# Altium schematic sheet MCU.SchDoc
size B; SheetNumber: 1; SheetTotal: 5
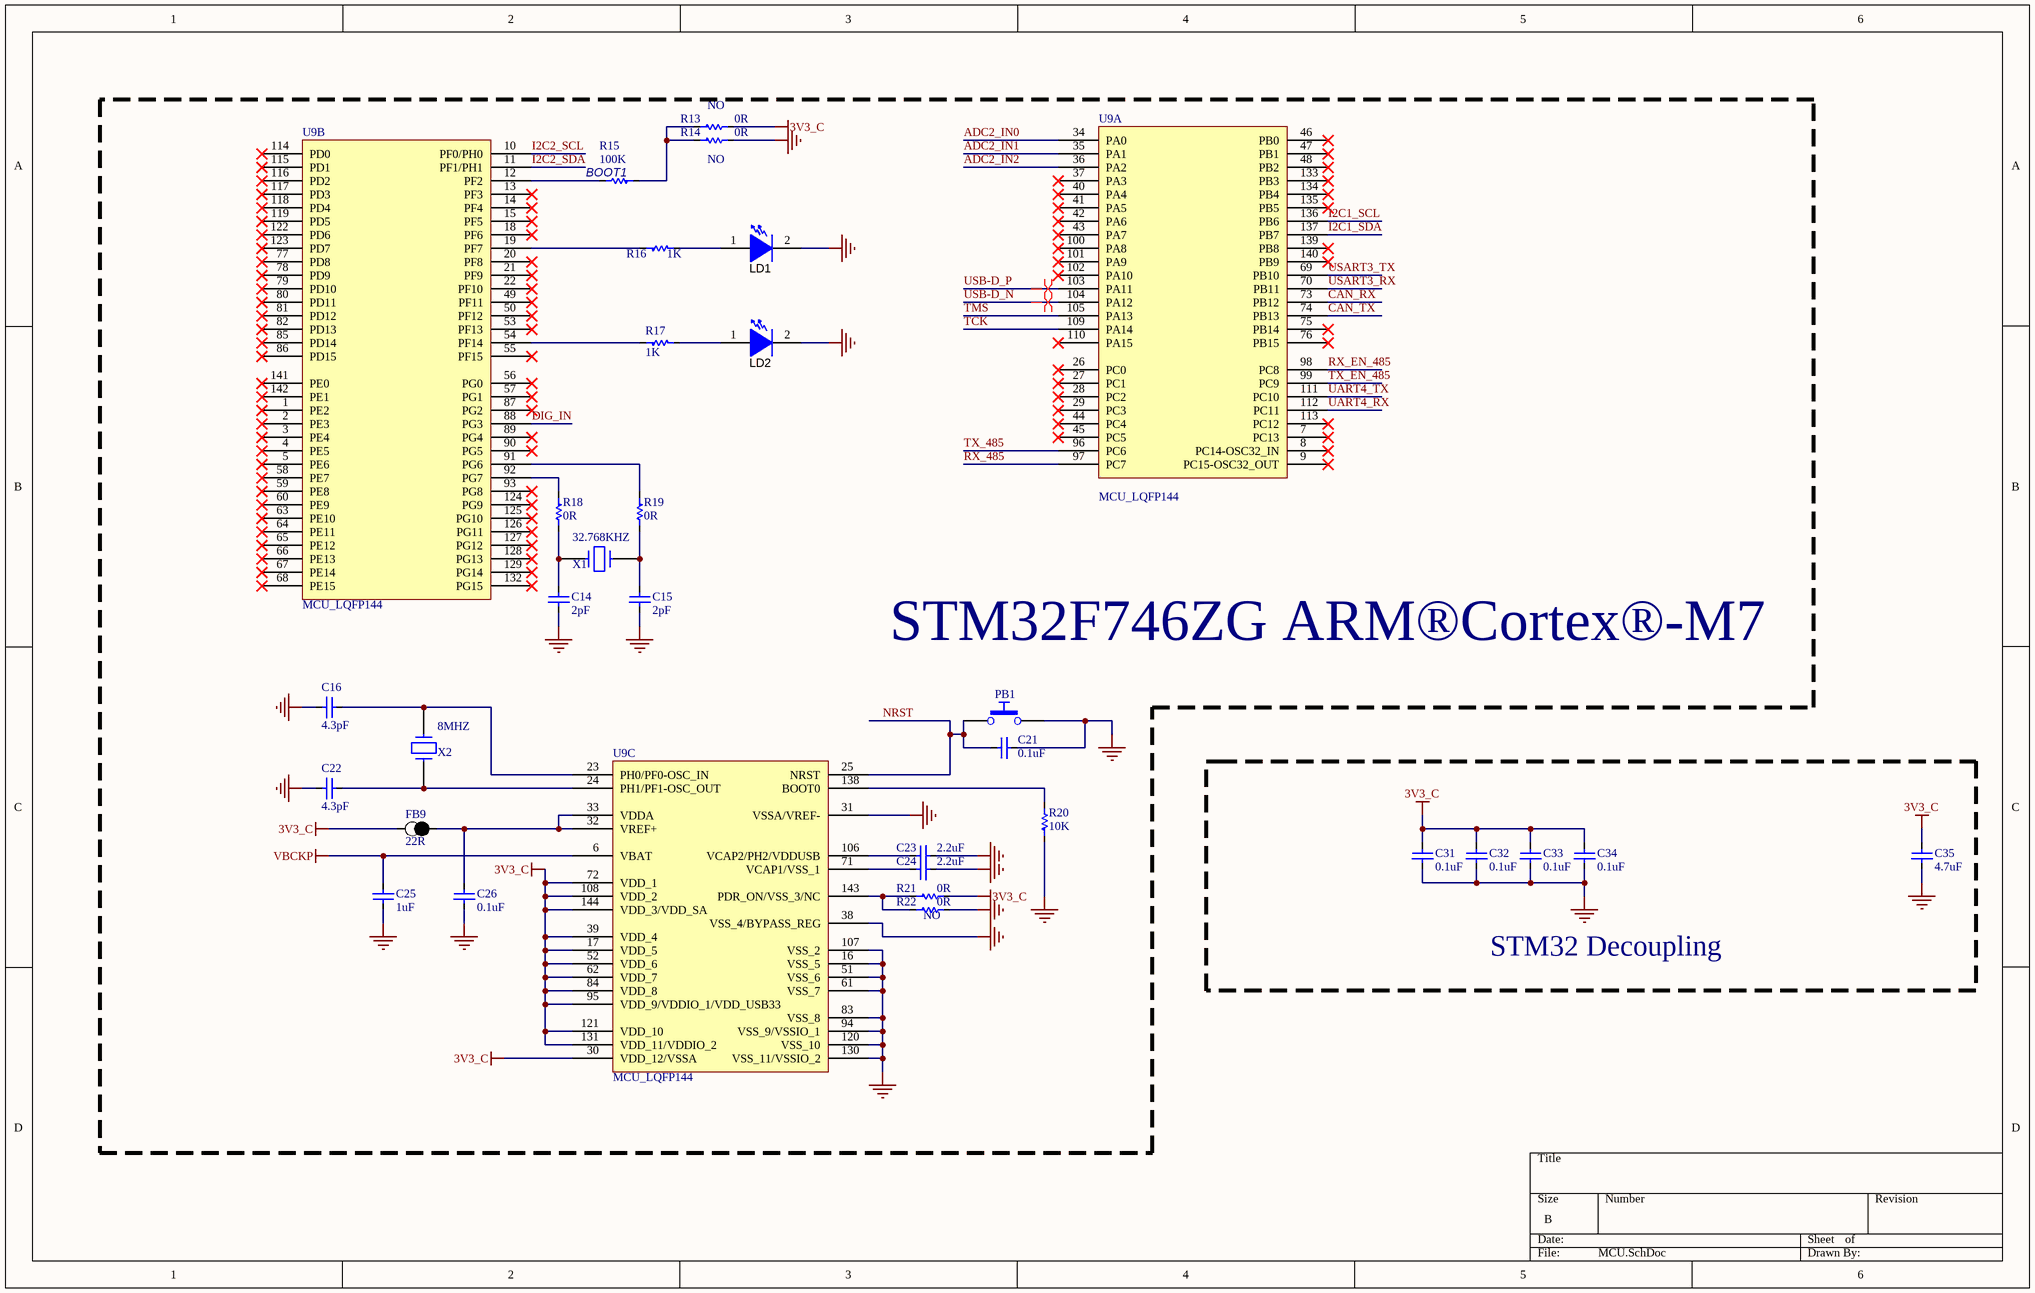
[diagram p0: MCU.SchDoc]

## Parts
C14  2pF  [CAPC1608-0603X85N]
C15  2pF  [CAPC1608-0603X85N]
C16  4.3pF  [CAPC1005-0402X55N]
C21  0.1uF  [CAPC1608-0603X85N]
C22  4.3pF  [CAPC1005-0402X55N]
C23  2.2uF  [CAPC2012-0805X80N]
C24  2.2uF  [CAPC2012-0805X80N]
C25  1uF  [CAPC1608-0603X85N]
C26  0.1uF  [CAPC1608-0603X85N]
C31  0.1uF  [CAPC1608-0603X85N]
C32  0.1uF  [CAPC1608-0603X85N]
C33  0.1uF  [CAPC1608-0603X85N]
C34  0.1uF  [CAPC1608-0603X85N]
C35  4.7uF  [CAPC1608-0603X85N]
FB9  22R  [INDC1608-0603X50N]
LD1  160-1183-1-ND  [LED_LTST-C190]  (value not drawn)
LD2  160-1183-1-ND  [LED_LTST-C190]  (value not drawn)
PB1  Push Button  [PB_TYCO_FSMSM]  (value not drawn)
R13  0R  POPULATED: NO  [RESC1608-0603X50N]
R14  0R  POPULATED: NO  [RESC1608-0603X50N]
R15  100K  [RESC1608-0603X50N]
R16  1K  [RESC1608-0603X50N]
R17  1K  [RESC1608-0603X50N]
R18  0R  [RESC1608-0603X50N]
R19  0R  [RESC1608-0603X50N]
R20  10K  [RESC1608-0603X50N]
R21  0R  [RESC1608-0603X50N]
R22  0R  POPULATED: NO  [RESC1608-0603X50N]
U9  MCU_LQFP144  [QFP50P2200X2200X160-144N]  (parts A,B,C of 3)
X1  32.768KHZ  [2-SMD]
X2  8MHZ  [2-SMD]

## Blocks framed on the sheet
STM32F746ZG ARM®Cortex®-M7: C14-C16 C21-C26 FB9 LD1 LD2 PB1 R13-R22 U9 X1 X2
STM32 Decoupling: C31-C35

## Nets
3V3_C: C31.1 C32.1 C33.1 C34.1 C35.1 FB9.2 R13.2 R21.2 U9.17(VDD_5) U9.30(VDD_12/VSSA) U9.39(VDD_4) U9.52(VDD_6) U9.62(VDD_7) U9.72(VDD_1) U9.84(VDD_8) U9.95(VDD_9/VDDIO_1/VDD_USB33) U9.108(VDD_2) U9.121(VDD_10) U9.131(VDD_11/VDDIO_2) U9.144(VDD_3/VDD_SA)
GND: C14.2 C15.2 C16.2 C21.2 C22.2 C23.2 C24.2 C25.1 C26.2 C31.2 C32.2 C33.2 C34.2 C35.2 LD1.2(K) LD2.2(K) PB1.2 R14.2 R20.1 R22.2 U9.16(VSS_5) U9.31(VSSA/VREF-) U9.38(VSS_4/BYPASS_REG) U9.51(VSS_6) U9.61(VSS_7) U9.83(VSS_8) U9.94(VSS_9/VSSIO_1) U9.107(VSS_2) U9.120(VSS_10) U9.130(VSS_11/VSSIO_2)
VBCKP: C25.2 U9.6(VBAT)
ADC2_IN0: U9.34(PA0)
ADC2_IN1: U9.35(PA1)
ADC2_IN2: U9.36(PA2)
CAN_RX: U9.73(PB12)
CAN_TX: U9.74(PB13)
DIG_IN: U9.88(PG3)
I2C1_SCL: U9.136(PB6)
I2C1_SDA: U9.137(PB7)
I2C2_SCL: U9.10(PF0/PH0)
I2C2_SDA: U9.11(PF1/PH1)
NRST: C21.1 PB1.1 U9.25(NRST)
RX_485: U9.97(PC7)
RX_EN_485: U9.98(PC8)
TCK: U9.109(PA14)
TMS: U9.105(PA13)
TX_485: U9.96(PC6)
TX_EN_485: U9.99(PC9)
UART4_RX: U9.112(PC11)
UART4_TX: U9.111(PC10)
USART3_RX: U9.70(PB11)
USART3_TX: U9.69(PB10)
USB-D_N: U9.104(PA12)
USB-D_P: U9.103(PA11)
NetC14_1: C14.1 R18.2 X1.1
NetC15_1: C15.1 R19.2 X1.2
NetC16_1: C16.1 U9.23(PH0/PF0-OSC_IN) X2.2
NetC22_1: C22.1 U9.24(PH1/PF1-OSC_OUT) X2.1
NetC23_1: C23.1 U9.106(VCAP2/PH2/VDDUSB)
NetC24_1: C24.1 U9.71(VCAP1/VSS_1)
NetC26_1: C26.1 FB9.1 U9.32(VREF+) U9.33(VDDA)
NetLD1_1: LD1.1(A) R16.2
NetLD2_1: LD2.1(A) R17.2
NetR13_1: R13.1 R14.1 R15.1
NetR15_2: R15.2 U9.12(PF2)
NetR16_1: R16.1 U9.19(PF7)
NetR17_1: R17.1 U9.54(PF14)
NetR18_1: R18.1 U9.92(PG7)
NetR19_1: R19.1 U9.91(PG6)
NetR20_2: R20.2 U9.138(BOOT0)
NetR21_1: R21.1 R22.1 U9.143(PDR_ON/VSS_3/NC)

Not connected (* = marked no-connect by the designer): U9 1(PE2)* 2(PE3)* 3(PE4)* 4(PE5)* 5(PE6)* 7(PC13)* 8(PC14-OSC32_IN)* 9(PC15-OSC32_OUT)* 13(PF3)* 14(PF4)* 15(PF5)* 18(PF6)* 20(PF8)* 21(PF9)* 22(PF10)* 26(PC0)* 27(PC1)* 28(PC2)* 29(PC3)* 37(PA3)* 40(PA4)* 41(PA5)* 42(PA6)* 43(PA7)* 44(PC4)* 45(PC5)* 46(PB0)* 47(PB1)* 48(PB2)* 49(PF11)* 50(PF12)* 53(PF13)* 55(PF15)* 56(PG0)* 57(PG1)* 58(PE7)* 59(PE8)* 60(PE9)* 63(PE10)* 64(PE11)* 65(PE12)* 66(PE13)* 67(PE14)* 68(PE15)* 75(PB14)* 76(PB15)* 77(PD8)* 78(PD9)* 79(PD10)* 80(PD11)* 81(PD12)* 82(PD13)* 85(PD14)* 86(PD15)* 87(PG2)* 89(PG4)* 90(PG5)* 93(PG8)* 100(PA8)* 101(PA9)* 102(PA10)* 110(PA15)* 113(PC12)* 114(PD0)* 115(PD1)* 116(PD2)* 117(PD3)* 118(PD4)* 119(PD5)* 122(PD6)* 123(PD7)* 124(PG9)* 125(PG10)* 126(PG11)* 127(PG12)* 128(PG13)* 129(PG14)* 132(PG15)* 133(PB3)* 134(PB4)* 135(PB5)* 139(PB8)* 140(PB9)* 141(PE0)* 142(PE1)*

## Layout directives
differential pair: USB-D_N, USB-D_P

## Notes on the sheet
- (near R15) BOOT1

## Library data of the parts
C14 C15 = Capacitor Ceramic: CAP CER 2PF 50V NPO 0603; MANUFACTURER PN: CC0603BRNPO9BN2R0; MANUFACTURER: Yageo; POPULATED: YES; TOLERANCE: ±0.1%; VOLTAGE: 50V; PACKAGE: 0603; DIGIKEY PN: 311-3827-1-ND
C16 C22 = Capacitor Ceramic: CAP CER 4.3PF 50V C0G/NPO 0402; MANUFACTURER PN: CC0402CRNPO9BN4R3; MANUFACTURER: Yageo; POPULATED: YES; TOLERANCE: ±0.25pF; VOLTAGE: 50V; PACKAGE: 0402; DIGIKEY PN: 311-1632-1-ND
C21 C26 C31-C34 = Capacitor Ceramic: CAP CER 0.1UF 25V X7R 0603; MANUFACTURER PN: CC0603KRX7R8BB104; MANUFACTURER: Yageo; POPULATED: YES; TOLERANCE: ±10%; VOLTAGE: 25V; PACKAGE: 0603; DIGIKEY PN: 1276-1000-2-ND(STOK)
C23 C24 = Capacitor Ceramic: CAP CER 2.2UF 16V X7R 0805; POPULATED: YES; TOLERANCE: ±10%; VOLTAGE: 16V; DIGIKEY PN: 1276-1162-1-ND
C25 = Capacitor Ceramic: CAP CER 1UF 25V X5R 0603; MANUFACTURER PN: CL10A105KA8NNNC; MANUFACTURER: Samsung Electro-Mechanics; POPULATED: YES; TOLERANCE: ±10%; VOLTAGE: 25V; PACKAGE: 0603; DIGIKEY PN: 1276-1184-2-ND(STOK)
C35 = Capacitor Ceramic: CAP CER 4.7UF 16V X5R 0603; MANUFACTURER PN: CC0603KRX5R7BB475; MANUFACTURER: Yageo; POPULATED: YES; TOLERANCE: ±10%; VOLTAGE: 16V; PACKAGE: 0603; DIGIKEY PN: 311-1785-1-ND
FB9 = Inductor EMI suppresion: FERRITE BEAD 22 OHM 0805 1LN; MANUFACTURER: Würth; MANUFACTURER PN: STOK; POPULATED: YES; TOLERANCE: -55°C ~ 125°C; DIGIKEY PN: STOK; PACKAGE: 0603
LD1 LD2 = LTST-C190GKT: LED, Green, SMD; DIGIKEY PN: 160-1183-1-ND
PB1 = PB_TYCO_FSMSM: Push-Button Switch SPDT; Part Description: 12VDC 50mA SPST Tactile  Push-Button Switch; Manufacturer: TYCO ELECTRONICS; Manufacturer Part Number: FSMSM or 1437566-3; Table: Switches; POPULATED: YES; Part Number: PB_TYCO_FSMSM; Component Kind: Standard; Component Type: Standard; Pin Count: 2; PackageDescription: Body 3.5x6.0mm, Pushbutton Switch,  TYCO ALCOSWITCH FSMSM Serie; Family: Push Button; Mounted: Yes; Socket: No; SMD: Yes; Status: None; ComponentHeight: 4.3mm; HelpURL: \\cern.ch\dfs\Applications\Altium\Datasheets\PB_TYCO_FSMSM.pdf; Author: CERN DEM JLC; CreateDate: 30.6.2008; LatestRevisionDate: 21.6.2012; DIGIKEY PN: 450-1140-ND
R13 R14 R22 = Resistor SMD: RES SMD 0 OHM JUMPER 1/10W 0603; MANUFACTURER: Yageo; MANUFACTURER PN: RC0603JR-070RL; TOLERANCE: ±1%; DIGIKEY PN: 311-0.0HRTR-ND(STOK); PACKAGE: 0603
R15 = Resistor SMD: RES SMD 100K OHM 1% 1/10W 0603; MANUFACTURER: Panasonic Electronic Components; MANUFACTURER PN: ERJ-3EKF1003V; POPULATED: YES; DIGIKEY PN: P100KHCT-ND; PACKAGE: 0603; TOLERANCE: 1%
R16 R17 = Resistor SMD: RES SMD 1K OHM 1% 1/10W 0603; MANUFACTURER: Panasonic Electronic Components; MANUFACTURER PN: ERJ-3EKF1001V; POPULATED: YES; DIGIKEY PN: 311-1.00KHRTR-ND(STOK); PACKAGE: 0603; TOLERANCE: 1%
R18 R19 R21 = Resistor SMD: RES SMD 0 OHM JUMPER 1/10W 0603; MANUFACTURER: Yageo; MANUFACTURER PN: RC0603JR-070RL; POPULATED: YES; TOLERANCE: ±1%; DIGIKEY PN: 311-0.0HRTR-ND(STOK); PACKAGE: 0603
R20 = Resistor SMD: RES SMD 10K OHM 1% 1/10W 0603; MANUFACTURER: Yageo; MANUFACTURER PN: RC0603FR-0710KL; POPULATED: YES; DIGIKEY PN: 311-10.0KHRTR-ND(STOK); PACKAGE: 0603; TOLERANCE: ±1%
X1 = CRYSTAL_32K: 32.768kHz  Crystal 6pF 70 kOhms 2-SMD, No Lead; MANUFACTURER: NDK America, Inc.; MANUFACTURER PN: NX3215SA-32.768KHZ-EXS00A-MU00525; POPULATED: YES; TOLERANCE: 6pF, 70 kOhms; VOLTAGE: -40°C ~ 85°C; DIGIKEY PN: 644-1386-1-ND; PACKAGE: 2-SMD; PRICE: 0.68
X2 = CRYSTAL_32K: CRYSTAL 8MHZ 8PF SMD; MANUFACTURER: NDK America, Inc.; MANUFACTURER PN: NX3225GD-8MHZ-EXS00A-CG04874; POPULATED: YES; TOLERANCE: 6pF, 70 kOhms; VOLTAGE: -40°C ~ 150°C; DIGIKEY PN: 644-1391-1-ND; PACKAGE: 2-SMD; PRICE: 0.68